# Altium schematic sheet AD_5689_DAC.SchDoc: DAC for Gate / Drain
size A4; Author: Watzek; DrawnBy: Watzek; Organization: HTL Hollabrunn; Address1: Abteilung Elektronik; Address2: Anton Ehrenfried-Straße 10; Address3: 2020 Hollabrunn; DocumentNumber: 05; Revision: 01; SheetNumber: 05; SheetTotal: 12; SPICEModelCacheXXRROZRR: <root> / <DocumentId>XXRROZRR</DocumentId> / <CacheFrame Number="0"> / <Model Name="cap" Kind="MDL"> / <Text>*Default semiconductor capacitor / .MODEL CAP C()</Text> / </Model> / </CacheFrame> / </root>
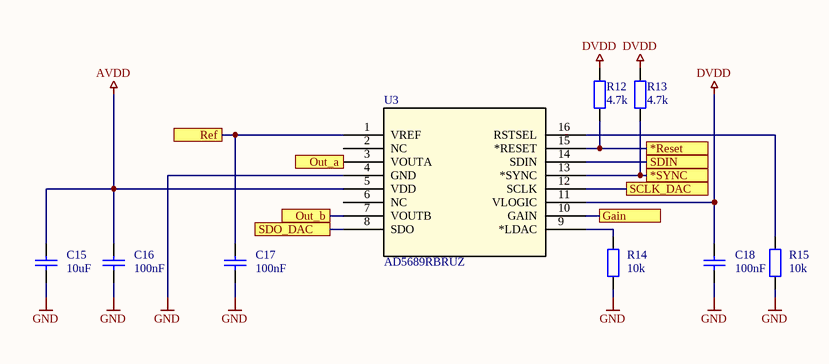
[diagram p0: AD_5689_DAC.SchDoc]

## Parts
C15  10uF  [C1206-KUE]
C16  100nF  [C1206-KUE]
C17  100nF  [C1206-KUE]
C18  100nF  [C1206-KUE]
R12  4.7k  [C1206-KUE]
R13  4.7k  [C1206-KUE]
R14  10k  [C1206-KUE]
R15  10k  [C1206-KUE]
U3  AD5689RBRUZ  [RU_16_ADI]

## Ports
*Reset, *SYNC, Gain, Out_a, Out_b, Ref, SCLK_DAC, SDIN, SDO_DAC

## Nets
AVDD: C15.2 C16.2 U3.5(VDD)
DVDD: C18.2 R12.1 R13.1 U3.11(VLOGIC)
GND: C15.1 C16.1 C17.1 C18.1 R14.2 R15.2 U3.4(GND)
*Reset: R12.2 U3.15(*RESET) ; port *Reset
*SYNC: R13.2 U3.13(*SYNC) ; port *SYNC
Gain: U3.10(GAIN) ; port Gain
Out_a: U3.3(VOUTA) ; port Out_a
Out_b: U3.7(VOUTB) ; port Out_b
Ref: C17.2 U3.1(VREF) ; port Ref
SCLK_DAC: U3.12(SCLK) ; port SCLK_DAC
SDIN: U3.14(SDIN) ; port SDIN
SDO_DAC: U3.8(SDO) ; port SDO_DAC
NetR14_1: R14.1 U3.9(*LDAC)
NetR15_1: R15.1 U3.16(RSTSEL)

Not connected (* = marked no-connect by the designer): U3 2(NC) 6(NC)

## Notes on the sheet
- Title
- Size:
- Date:
- A4
- Number:
- Time:
- Revision:
- Sheet
- of
- HTL Hollabrunn
- Abteilung Elektronik
- Anton Ehrenfried-Straße 10
- 2020 Hollabrunn
- File:
- Drawn By:

## Library data of the parts
C15-C18 = Capacitor: Manufacturer: Kemet; Bezeichnung: Kerko +-10% 63V; Published: 8-Jun-2000; LatestRevisionDate: 17-Jul-2002; LatestRevisionNote: Re-released for DXP Platform.; PackageReference: RAD-0.3; Publisher: Altium Limited; PackageDescription: Radial Cap, Thru-Hole; 2 Leads; 0.3 in Pin Spacing; Orderingcode: *
  C15: Value: 10uF
  C16-C18: Value: 100nF
R12-R15 = ResistorSMD: Resistor SMD; Manufacturer: AVX; Bezeichnung: SMD Wid. 1/8W 2%; Published: 8-Jun-2000; LatestRevisionDate: 17-Jul-2002; LatestRevisionNote: Re-released for DXP Platform.; PackageReference: AXIAL-0.4; Publisher: Altium Limited; PackageDescription: Axial Device, Thru-Hole; 2 Leads; 0.4 in Pin Spacing; Orderingcode: *
  R12 R13: Value: 4.7k
  R14 R15: Value: 10k
U3 = AD5689RBRUZ: Dual, 16-Bit nanoDAC+ with 2 ppm/Â°C Reference, SPI Interface; Manufacturer_Name: Analog Devices Inc; Copyright: Copyright (C) 2026 Ultra Librarian. All rights reserved.; Manufacturer_Part_Number: AD5689RBRUZ; RefDes: RefDes; Type: Type